# Altium schematic sheet Flame.SchDoc
size A4
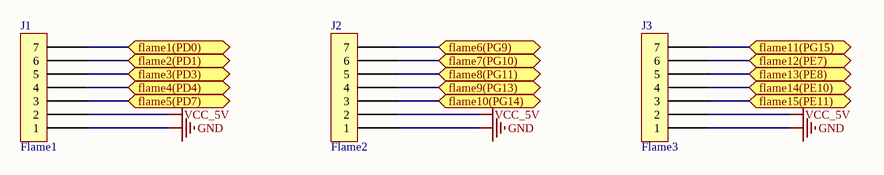
[diagram p0: Flame.SchDoc]

## Parts
J1  Flame1  [XH2.54-LI-7P]
J2  Flame2  [XH2.54-LI-7P]
J3  Flame3  [XH2.54-LI-7P]

## Ports
flame1(PD0) (bidir), flame2(PD1) (bidir), flame3(PD3) (bidir), flame4(PD4) (bidir), flame5(PD7) (bidir), flame6(PG9) (bidir), flame7(PG10) (bidir), flame8(PG11) (bidir), flame9(PG13) (bidir), flame10(PG14) (bidir), flame11(PG15) (bidir), flame12(PE7) (bidir), flame13(PE8) (bidir), flame14(PE10) (bidir), flame15(PE11) (bidir)

## Nets
GND: J1.1 J2.1 J3.1
VCC_5V: J1.2 J2.2 J3.2
flame1(PD0): J1.7 ; port flame1(PD0)
flame2(PD1): J1.6 ; port flame2(PD1)
flame3(PD3): J1.5 ; port flame3(PD3)
flame4(PD4): J1.4 ; port flame4(PD4)
flame5(PD7): J1.3 ; port flame5(PD7)
flame6(PG9): J2.7 ; port flame6(PG9)
flame7(PG10): J2.6 ; port flame7(PG10)
flame8(PG11): J2.5 ; port flame8(PG11)
flame9(PG13): J2.4 ; port flame9(PG13)
flame10(PG14): J2.3 ; port flame10(PG14)
flame11(PG15): J3.7 ; port flame11(PG15)
flame12(PE7): J3.6 ; port flame12(PE7)
flame13(PE8): J3.5 ; port flame13(PE8)
flame14(PE10): J3.4 ; port flame14(PE10)
flame15(PE11): J3.3 ; port flame15(PE11)

## Library data of the parts
J1-J3 = Component_1